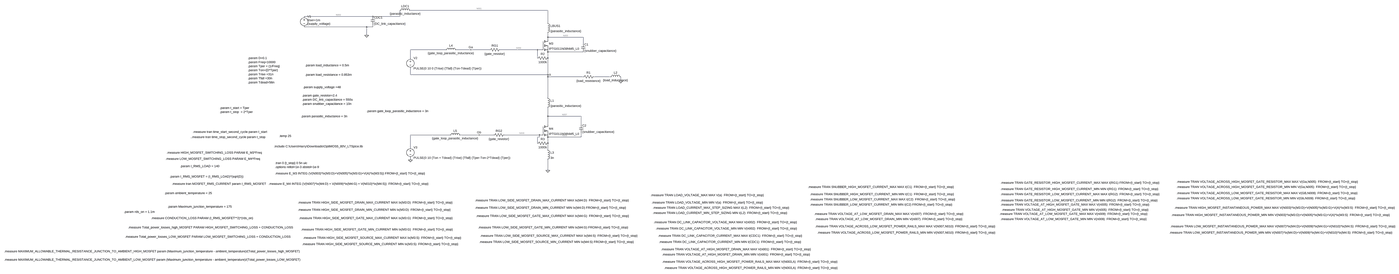
[diagram p0: schematic LTspice_simulation_ready.asc, whole sheet]
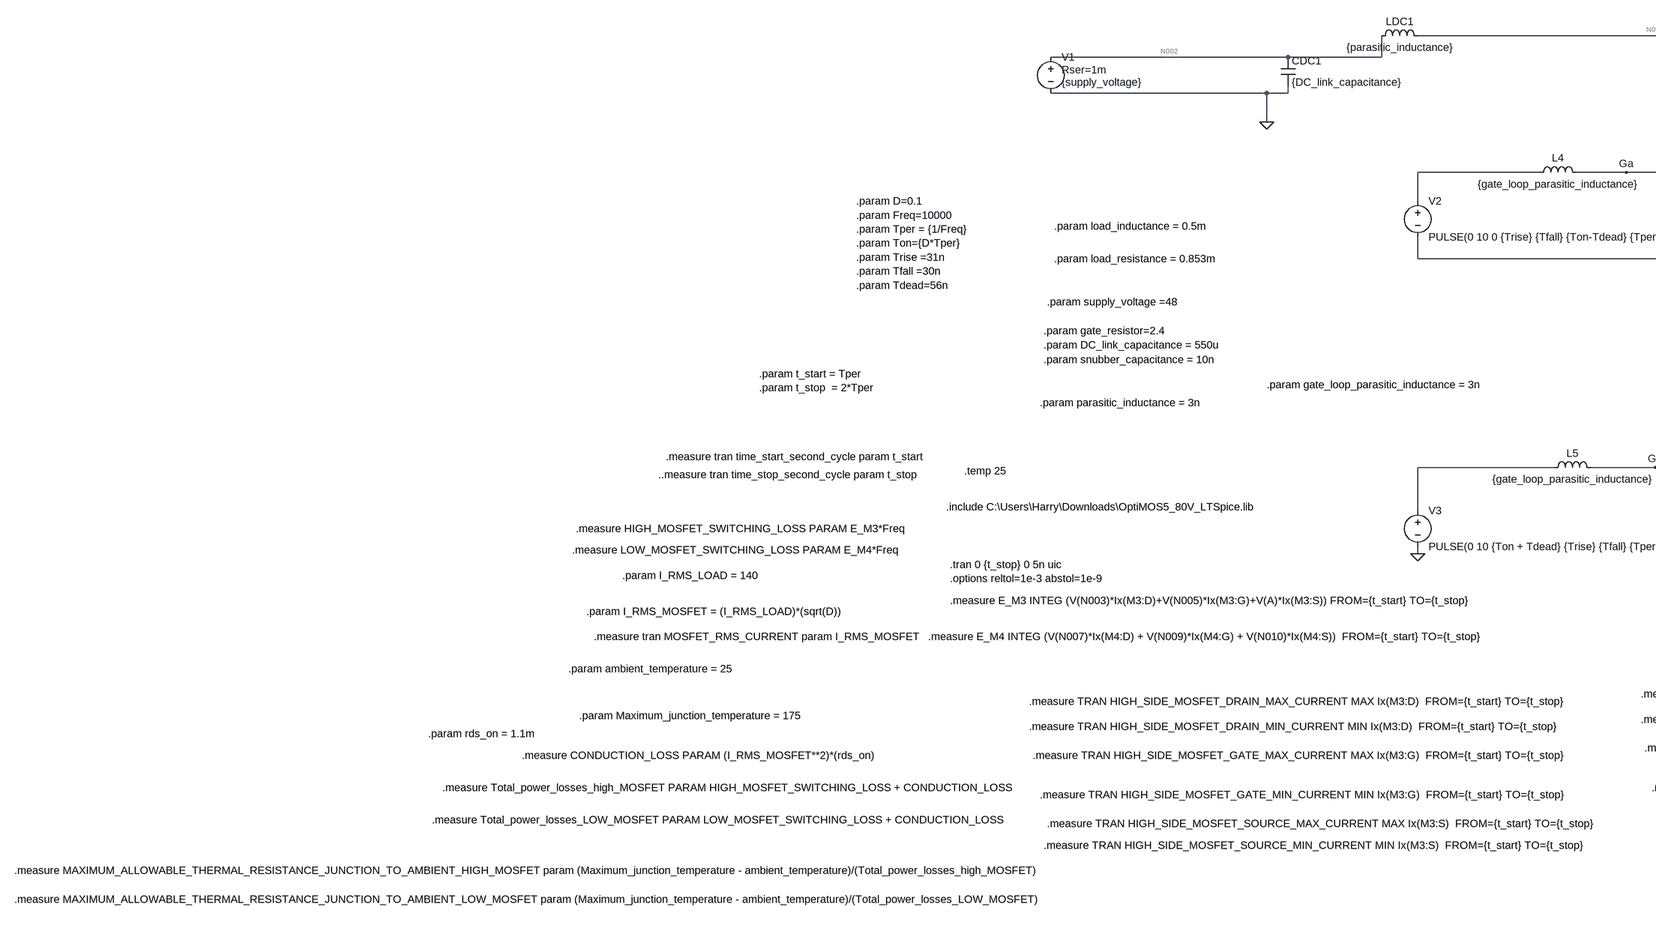
[diagram p1: schematic LTspice_simulation_ready.asc, part, row 1 of 1, column 1 of 3]
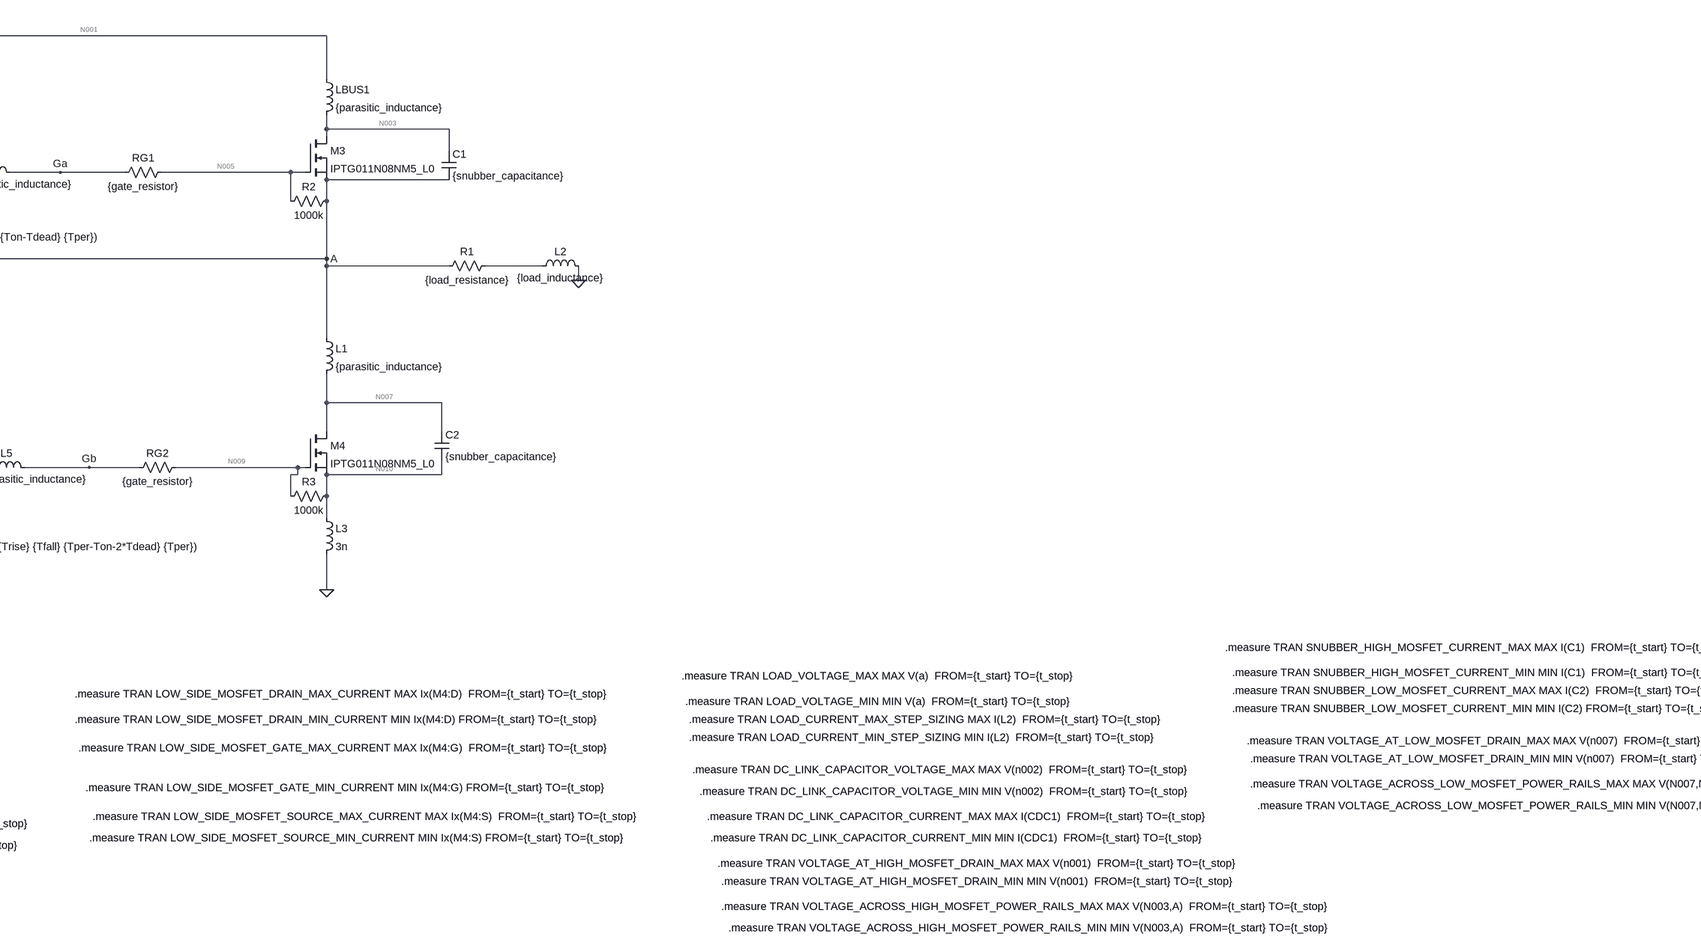
[diagram p2: schematic LTspice_simulation_ready.asc, part, row 1 of 1, column 2 of 3]
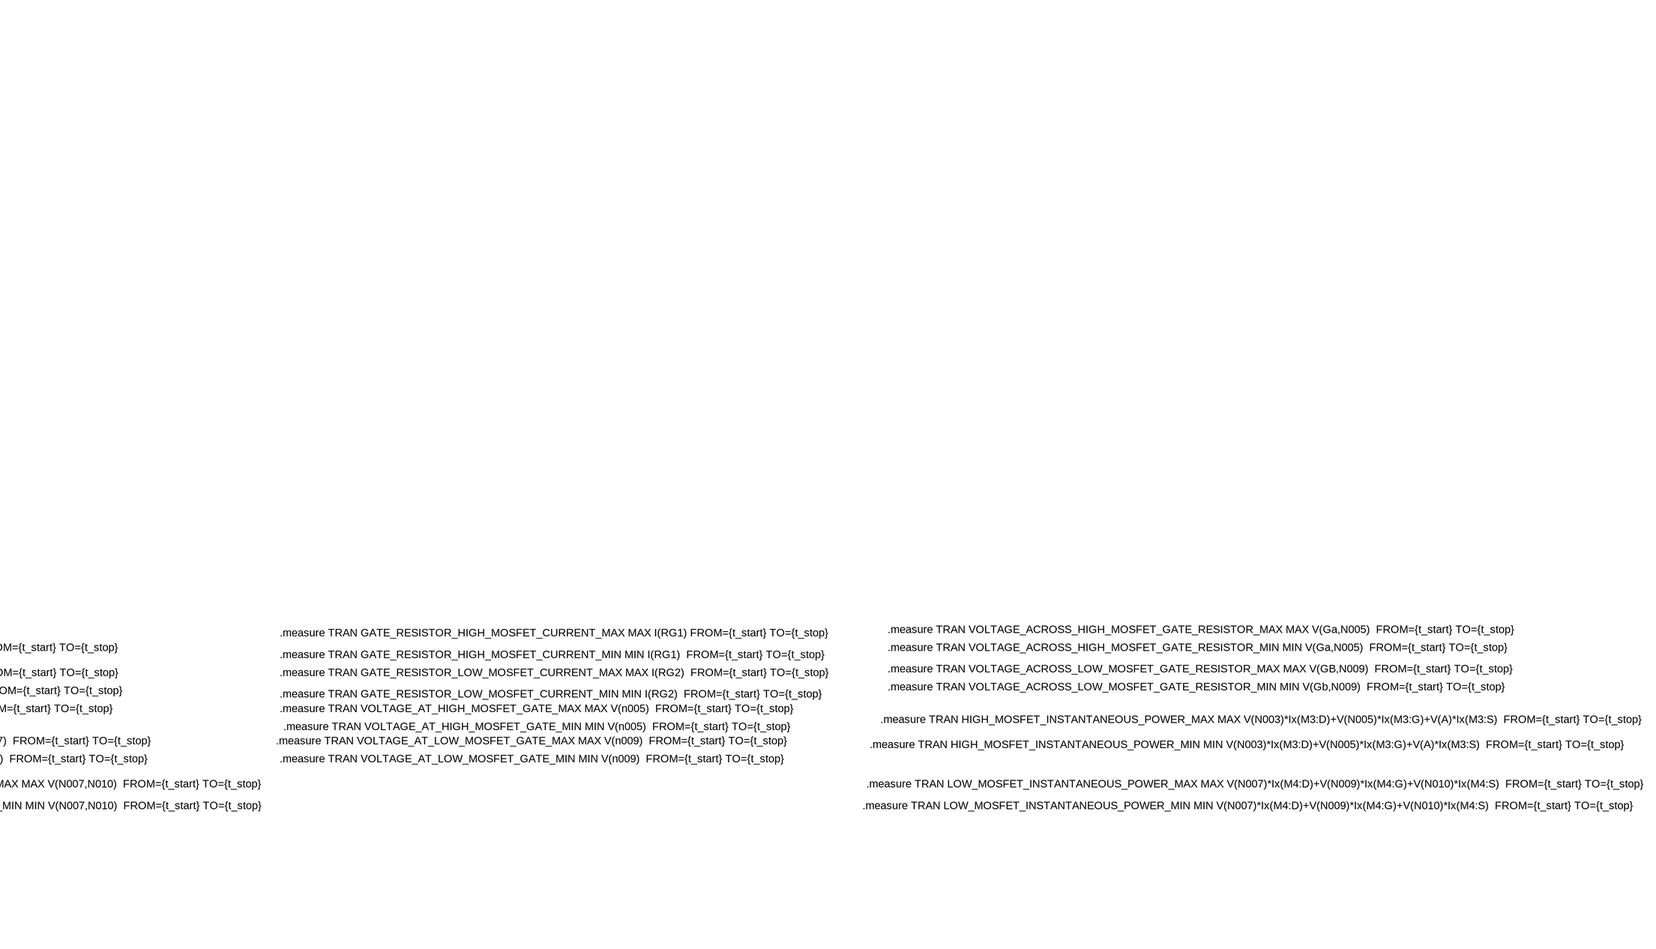
[diagram p3: schematic LTspice_simulation_ready.asc, part, row 1 of 1, column 3 of 3]
LTspice_simulation_ready.asc, the LTspice schematic file:
Version 4.1
SHEET 1 7924 1440
WIRE 1136 -560 80 -560
WIRE -208 -512 -736 -512
WIRE 0 -512 0 -560
WIRE 0 -512 -208 -512
WIRE 1136 -464 1136 -560
WIRE -256 -432 -736 -432
WIRE -208 -432 -208 -448
WIRE -208 -432 -256 -432
WIRE -256 -368 -256 -432
WIRE 1136 -352 1136 -384
WIRE 1408 -352 1136 -352
WIRE 1136 -336 1136 -352
WIRE 1408 -304 1408 -352
WIRE 352 -256 80 -256
WIRE 544 -256 432 -256
WIRE 688 -256 544 -256
WIRE 1056 -256 768 -256
WIRE 1088 -256 1056 -256
WIRE 1408 -240 1136 -240
WIRE 80 -192 80 -256
WIRE 1056 -192 1056 -256
WIRE 1136 -192 1136 -240
WIRE 80 -64 80 -112
WIRE 1136 -64 1136 -192
WIRE 1136 -64 80 -64
WIRE 1136 -48 1136 -64
WIRE 1408 -48 1136 -48
WIRE 1616 -48 1488 -48
WIRE 1696 -16 1696 -48
WIRE 1136 112 1136 -48
WIRE 1136 256 1136 192
WIRE 1392 256 1136 256
WIRE 1136 320 1136 256
WIRE 1392 320 1392 256
WIRE 384 400 80 400
WIRE 608 400 464 400
WIRE 720 400 608 400
WIRE 1072 400 800 400
WIRE 1088 400 1072 400
WIRE 1072 416 1072 400
WIRE 1072 416 1056 416
WIRE 1136 416 1136 400
WIRE 1392 416 1392 384
WIRE 1392 416 1136 416
WIRE 1056 464 1056 416
WIRE 1136 464 1136 416
WIRE 80 496 80 400
WIRE 1136 512 1136 464
WIRE 80 592 80 576
WIRE 1136 672 1136 592
FLAG 544 -256 Ga
FLAG 608 400 Gb
FLAG 1696 -16 0
FLAG 1136 -64 A
FLAG -256 -368 0
FLAG 1136 672 0
FLAG 80 592 0
SYMBOL voltage -736 -528 R0
WINDOW 123 0 0 Left 0
WINDOW 39 24 44 Left 2
WINDOW 3 24 72 Left 2
SYMATTR SpiceLine Rser=1m
SYMATTR Value {supply_voltage}
SYMATTR InstName V1
SYMBOL cap -224 -512 R0
SYMATTR InstName CDC1
SYMATTR Value {DC_link_capacitance}
SYMATTR SpiceLine Rser=1m
SYMBOL ind -16 -544 R270
WINDOW 0 32 56 VTop 2
WINDOW 3 5 56 VBottom 2
SYMATTR InstName LDC1
SYMATTR Value {parasitic_inductance}
SYMATTR SpiceLine Rser=1m
SYMBOL res 1504 -64 R90
WINDOW 0 0 56 VBottom 2
WINDOW 3 32 56 VTop 2
SYMATTR InstName R1
SYMATTR Value {load_resistance}
SYMBOL res 784 -272 R90
WINDOW 0 0 56 VBottom 2
WINDOW 3 32 56 VTop 2
SYMATTR InstName RG1
SYMATTR Value {gate_resistor}
SYMBOL res 816 384 R90
WINDOW 0 0 56 VBottom 2
WINDOW 3 32 56 VTop 2
SYMATTR InstName RG2
SYMATTR Value {gate_resistor}
SYMBOL ind 1120 -480 R0
SYMATTR InstName LBUS1
SYMATTR Value {parasitic_inductance}
SYMATTR SpiceLine Rser=1m
SYMBOL ind 1120 96 R0
SYMATTR InstName L1
SYMATTR Value {parasitic_inductance}
SYMATTR SpiceLine Rser=1m
SYMBOL ind 1600 -32 R270
WINDOW 0 32 56 VTop 2
WINDOW 3 5 56 VBottom 2
SYMATTR InstName L2
SYMATTR Value {load_inductance}
SYMATTR SpiceLine Rser=1m
SYMBOL ind 1120 496 R0
SYMATTR InstName L3
SYMATTR Value 3n
SYMATTR SpiceLine Rser=1m
SYMBOL voltage 80 -208 R0
WINDOW 123 0 0 Left 0
WINDOW 39 0 0 Left 0
SYMATTR InstName V2
SYMATTR Value PULSE(0 10 0 {Trise} {Tfall} {Ton-Tdead} {Tper})
SYMBOL voltage 80 480 R0
WINDOW 123 0 0 Left 0
WINDOW 39 0 0 Left 0
SYMATTR InstName V3
SYMATTR Value PULSE(0 10 {Ton + Tdead} {Trise} {Tfall} {Tper-Ton-2*Tdead} {Tper})
SYMBOL ind 336 -240 R270
WINDOW 0 32 56 VTop 2
WINDOW 3 5 56 VBottom 2
SYMATTR InstName L4
SYMATTR Value {gate_loop_parasitic_inductance}
SYMATTR SpiceLine Rser=1m
SYMBOL ind 368 416 R270
WINDOW 0 32 56 VTop 2
WINDOW 3 5 56 VBottom 2
SYMATTR InstName L5
SYMATTR Value {gate_loop_parasitic_inductance}
SYMATTR SpiceLine Rser=1m
SYMBOL res 1152 -208 R90
WINDOW 0 0 56 VBottom 2
WINDOW 3 32 56 VTop 2
SYMATTR InstName R2
SYMATTR Value 1000k
SYMBOL res 1152 448 R90
WINDOW 0 0 56 VBottom 2
WINDOW 3 32 56 VTop 2
SYMATTR InstName R3
SYMATTR Value 1000k
SYMBOL cap 1392 -304 R0
SYMATTR InstName C1
SYMATTR Value {snubber_capacitance}
SYMBOL cap 1376 320 R0
SYMATTR InstName C2
SYMATTR Value {snubber_capacitance}
SYMBOL nmos 1088 -336 R0
SYMATTR InstName M3
SYMATTR Value IPTG011N08NM5_L0
SYMATTR Prefix X
SYMBOL nmos 1088 320 R0
SYMATTR InstName M4
SYMATTR Value IPTG011N08NM5_L0
SYMATTR Prefix X
TEXT -1168 -192 Left 2 !.param D=0.1\n.param Freq=10000\n.param Tper = {1/Freq}\n.param Ton={D*Tper}\n.param Trise =31n\n.param Tfall =30n\n.param Tdead=56n
TEXT -960 616 Left 2 !.tran 0 {t_stop} 0 5n uic\n.options reltol=1e-3 abstol=1e-9
TEXT -968 488 Left 2 !.include C:\\Users\\Harry\\Downloads\\OptiMOS5_80V_LTSpice.lib
TEXT -928 408 Left 2 !.temp 25
TEXT -752 160 Left 2 !.param snubber_capacitance = 10n
TEXT -752 128 Left 2 !.param DC_link_capacitance = 550u
TEXT -752 96 Left 2 !.param gate_resistor=2.4
TEXT -744 32 Left 2 !.param supply_voltage =48
TEXT -728 -64 Left 2 !.param load_resistance = 0.853m
TEXT -728 -136 Left 2 !.param load_inductance = 0.5m
TEXT -760 256 Left 2 !.param parasitic_inductance = 3n
TEXT -960 696 Left 2 !.measure E_M3 INTEG (V(N003)*Ix(M3:D)+V(N005)*Ix(M3:G)+V(A)*Ix(M3:S)) FROM={t_start} TO={t_stop}
TEXT -1008 776 Left 2 !.measure E_M4 INTEG (V(N007)*Ix(M4:D) + V(N009)*Ix(M4:G) + V(N010)*Ix(M4:S))  FROM={t_start} TO={t_stop}
TEXT -784 920 Left 2 !.measure TRAN HIGH_SIDE_MOSFET_DRAIN_MAX_CURRENT MAX Ix(M3:D)  FROM={t_start} TO={t_stop}
TEXT -784 976 Left 2 !.measure TRAN HIGH_SIDE_MOSFET_DRAIN_MIN_CURRENT MIN Ix(M3:D)  FROM={t_start} TO={t_stop}
TEXT -776 1040 Left 2 !.measure TRAN HIGH_SIDE_MOSFET_GATE_MAX_CURRENT MAX Ix(M3:G)  FROM={t_start} TO={t_stop}
TEXT -760 1128 Left 2 !.measure TRAN HIGH_SIDE_MOSFET_GATE_MIN_CURRENT MIN Ix(M3:G)  FROM={t_start} TO={t_stop}
TEXT -752 1240 Left 2 !.measure TRAN HIGH_SIDE_MOSFET_SOURCE_MIN_CURRENT MIN Ix(M3:S)  FROM={t_start} TO={t_stop}
TEXT -744 1192 Left 2 !.measure TRAN HIGH_SIDE_MOSFET_SOURCE_MAX_CURRENT MAX Ix(M3:S)  FROM={t_start} TO={t_stop}
TEXT 576 904 Left 2 !.measure TRAN LOW_SIDE_MOSFET_DRAIN_MAX_CURRENT MAX Ix(M4:D)  FROM={t_start} TO={t_stop}
TEXT 576 960 Left 2 !.measure TRAN LOW_SIDE_MOSFET_DRAIN_MIN_CURRENT MIN Ix(M4:D) FROM={t_start} TO={t_stop}
TEXT 584 1024 Left 2 !.measure TRAN LOW_SIDE_MOSFET_GATE_MAX_CURRENT MAX Ix(M4:G)  FROM={t_start} TO={t_stop}
TEXT 600 1112 Left 2 !.measure TRAN LOW_SIDE_MOSFET_GATE_MIN_CURRENT MIN Ix(M4:G) FROM={t_start} TO={t_stop}
TEXT 608 1224 Left 2 !.measure TRAN LOW_SIDE_MOSFET_SOURCE_MIN_CURRENT MIN Ix(M4:S) FROM={t_start} TO={t_stop}
TEXT 616 1176 Left 2 !.measure TRAN LOW_SIDE_MOSFET_SOURCE_MAX_CURRENT MAX Ix(M4:S)  FROM={t_start} TO={t_stop}
TEXT 2072 864 Left 2 !.measure TRAN LOAD_VOLTAGE_MAX MAX V(a)  FROM={t_start} TO={t_stop}
TEXT 2080 920 Left 2 !.measure TRAN LOAD_VOLTAGE_MIN MIN V(a)  FROM={t_start} TO={t_stop}
TEXT 2088 960 Left 2 !.measure TRAN LOAD_CURRENT_MAX_STEP_SIZING MAX I(L2)  FROM={t_start} TO={t_stop}
TEXT 2088 1000 Left 2 !.measure TRAN LOAD_CURRENT_MIN_STEP_SIZING MIN I(L2)  FROM={t_start} TO={t_stop}
TEXT 2096 1072 Left 2 !.measure TRAN DC_LINK_CAPACITOR_VOLTAGE_MAX MAX V(n002)  FROM={t_start} TO={t_stop}
TEXT 2112 1120 Left 2 !.measure TRAN DC_LINK_CAPACITOR_VOLTAGE_MIN MIN V(n002)  FROM={t_start} TO={t_stop}
TEXT 2128 1176 Left 2 !.measure TRAN DC_LINK_CAPACITOR_CURRENT_MAX MAX I(CDC1)  FROM={t_start} TO={t_stop}
TEXT 2136 1224 Left 2 !.measure TRAN DC_LINK_CAPACITOR_CURRENT_MIN MIN I(CDC1)  FROM={t_start} TO={t_stop}
TEXT 2152 1280 Left 2 !.measure TRAN VOLTAGE_AT_HIGH_MOSFET_DRAIN_MAX MAX V(n001)  FROM={t_start} TO={t_stop}
TEXT 2160 1320 Left 2 !.measure TRAN VOLTAGE_AT_HIGH_MOSFET_DRAIN_MIN MIN V(n001)  FROM={t_start} TO={t_stop}
TEXT 2160 1376 Left 2 !.measure TRAN VOLTAGE_ACROSS_HIGH_MOSFET_POWER_RAILS_MAX MAX V(N003,A)  FROM={t_start} TO={t_stop}
TEXT 2176 1424 Left 2 !.measure TRAN VOLTAGE_ACROSS_HIGH_MOSFET_POWER_RAILS_MIN MIN V(N003,A)  FROM={t_start} TO={t_stop}
TEXT 3280 800 Left 2 !.measure TRAN SNUBBER_HIGH_MOSFET_CURRENT_MAX MAX I(C1)  FROM={t_start} TO={t_stop}
TEXT 3296 856 Left 2 !.measure TRAN SNUBBER_HIGH_MOSFET_CURRENT_MIN MIN I(C1)  FROM={t_start} TO={t_stop}
TEXT 3296 896 Left 2 !.measure TRAN SNUBBER_LOW_MOSFET_CURRENT_MAX MAX I(C2)  FROM={t_start} TO={t_stop}
TEXT 3296 936 Left 2 !.measure TRAN SNUBBER_LOW_MOSFET_CURRENT_MIN MIN I(C2) FROM={t_start} TO={t_stop}
TEXT 3328 1008 Left 2 !.measure TRAN VOLTAGE_AT_LOW_MOSFET_DRAIN_MAX MAX V(n007)  FROM={t_start} TO={t_stop}
TEXT 3336 1048 Left 2 !.measure TRAN VOLTAGE_AT_LOW_MOSFET_DRAIN_MIN MIN V(n007)  FROM={t_start} TO={t_stop}
TEXT 3336 1104 Left 2 !.measure TRAN VOLTAGE_ACROSS_LOW_MOSFET_POWER_RAILS_MAX MAX V(N007,N010)  FROM={t_start} TO={t_stop}
TEXT 3352 1152 Left 2 !.measure TRAN VOLTAGE_ACROSS_LOW_MOSFET_POWER_RAILS_MIN MIN V(N007,N010)  FROM={t_start} TO={t_stop}
TEXT 4760 768 Left 2 !.measure TRAN GATE_RESISTOR_HIGH_MOSFET_CURRENT_MAX MAX I(RG1) FROM={t_start} TO={t_stop}
TEXT 4760 816 Left 2 !.measure TRAN GATE_RESISTOR_HIGH_MOSFET_CURRENT_MIN MIN I(RG1)  FROM={t_start} TO={t_stop}
TEXT 4760 856 Left 2 !.measure TRAN GATE_RESISTOR_LOW_MOSFET_CURRENT_MAX MAX I(RG2)  FROM={t_start} TO={t_stop}
TEXT 4760 904 Left 2 !.measure TRAN GATE_RESISTOR_LOW_MOSFET_CURRENT_MIN MIN I(RG2)  FROM={t_start} TO={t_stop}
TEXT 4760 936 Left 2 !.measure TRAN VOLTAGE_AT_HIGH_MOSFET_GATE_MAX MAX V(n005)  FROM={t_start} TO={t_stop}
TEXT 4768 976 Left 2 !.measure TRAN VOLTAGE_AT_HIGH_MOSFET_GATE_MIN MIN V(n005)  FROM={t_start} TO={t_stop}
TEXT 4752 1008 Left 2 !.measure TRAN VOLTAGE_AT_LOW_MOSFET_GATE_MAX MAX V(n009)  FROM={t_start} TO={t_stop}
TEXT 4760 1048 Left 2 !.measure TRAN VOLTAGE_AT_LOW_MOSFET_GATE_MIN MIN V(n009)  FROM={t_start} TO={t_stop}
TEXT 6112 760 Left 2 !.measure TRAN VOLTAGE_ACROSS_HIGH_MOSFET_GATE_RESISTOR_MAX MAX V(Ga,N005)  FROM={t_start} TO={t_stop}
TEXT 6112 800 Left 2 !.measure TRAN VOLTAGE_ACROSS_HIGH_MOSFET_GATE_RESISTOR_MIN MIN V(Ga,N005)  FROM={t_start} TO={t_stop}
TEXT 6112 848 Left 2 !.measure TRAN VOLTAGE_ACROSS_LOW_MOSFET_GATE_RESISTOR_MAX MAX V(GB,N009)  FROM={t_start} TO={t_stop}
TEXT 6112 888 Left 2 !.measure TRAN VOLTAGE_ACROSS_LOW_MOSFET_GATE_RESISTOR_MIN MIN V(Gb,N009)  FROM={t_start} TO={t_stop}
TEXT 6096 960 Left 2 !.measure TRAN HIGH_MOSFET_INSTANTANEOUS_POWER_MAX MAX V(N003)*Ix(M3:D)+V(N005)*Ix(M3:G)+V(A)*Ix(M3:S)  FROM={t_start} TO={t_stop}
TEXT 6072 1016 Left 2 !.measure TRAN HIGH_MOSFET_INSTANTANEOUS_POWER_MIN MIN V(N003)*Ix(M3:D)+V(N005)*Ix(M3:G)+V(A)*Ix(M3:S)  FROM={t_start} TO={t_stop}
TEXT 6064 1104 Left 2 !.measure TRAN LOW_MOSFET_INSTANTANEOUS_POWER_MAX MAX V(N007)*Ix(M4:D)+V(N009)*Ix(M4:G)+V(N010)*Ix(M4:S)  FROM={t_start} TO={t_stop}
TEXT 6056 1152 Left 2 !.measure TRAN LOW_MOSFET_INSTANTANEOUS_POWER_MIN MIN V(N007)*Ix(M4:D)+V(N009)*Ix(M4:G)+V(N010)*Ix(M4:S)  FROM={t_start} TO={t_stop}
TEXT -256 216 Left 2 !.param gate_loop_parasitic_inductance = 3n
TEXT -1384 192 Left 2 !.param t_start = Tper\n.param t_stop  = 2*Tper
TEXT -1592 376 Left 2 !.measure tran time_start_second_cycle param t_start
TEXT -1608 416 Left 2 !..measure tran time_stop_second_cycle param t_stop
TEXT -1792 536 Left 2 !.measure HIGH_MOSFET_SWITCHING_LOSS PARAM E_M3*Freq
TEXT -1800 584 Left 2 !.measure LOW_MOSFET_SWITCHING_LOSS PARAM E_M4*Freq
TEXT -1688 640 Left 2 !.param I_RMS_LOAD = 140
TEXT -1768 720 Left 2 !.param I_RMS_MOSFET = (I_RMS_LOAD)*(sqrt(D))
TEXT -1752 776 Left 2 !.measure tran MOSFET_RMS_CURRENT param I_RMS_MOSFET
TEXT -1808 848 Left 2 !.param ambient_temperature = 25
TEXT -1784 952 Left 2 !.param Maximum_junction_temperature = 175
TEXT -2088 1112 Left 2 !.measure Total_power_losses_high_MOSFET PARAM HIGH_MOSFET_SWITCHING_LOSS + CONDUCTION_LOSS
TEXT -1912 1040 Left 2 !.measure CONDUCTION_LOSS PARAM (I_RMS_MOSFET**2)*(rds_on)
TEXT -2120 992 Left 2 !.param rds_on = 1.1m
TEXT -2112 1184 Left 2 !.measure Total_power_losses_LOW_MOSFET PARAM LOW_MOSFET_SWITCHING_LOSS + CONDUCTION_LOSS
TEXT -3040 1296 Left 2 !.measure MAXIMUM_ALLOWABLE_THERMAL_RESISTANCE_JUNCTION_TO_AMBIENT_HIGH_MOSFET param (Maximum_junction_temperature - ambient_temperature)/(Total_power_losses_high_MOSFET)
TEXT -3040 1360 Left 2 !.measure MAXIMUM_ALLOWABLE_THERMAL_RESISTANCE_JUNCTION_TO_AMBIENT_LOW_MOSFET param (Maximum_junction_temperature - ambient_temperature)/(Total_power_losses_LOW_MOSFET)

The netlist it stands for:
* LTspice_simulation_ready.asc
V1 N002 0 {supply_voltage} Rser=1m
CDC1 N002 0 {DC_link_capacitance} Rser=1m
LDC1 N002 N001 {parasitic_inductance} Rser=1m
R1 N006 A {load_resistance}
RG1 N005 Ga {gate_resistor}
RG2 N009 Gb {gate_resistor}
LBUS1 N001 N003 {parasitic_inductance} Rser=1m
L1 A N007 {parasitic_inductance} Rser=1m
L2 N006 0 {load_inductance} Rser=1m
L3 N010 0 3n Rser=1m
V2 N004 A PULSE(0 10 0 {Trise} {Tfall} {Ton-Tdead} {Tper})
V3 N008 0 PULSE(0 10 {Ton + Tdead} {Trise} {Tfall} {Tper-Ton-2*Tdead} {Tper})
L4 N004 Ga {gate_loop_parasitic_inductance} Rser=1m
L5 N008 Gb {gate_loop_parasitic_inductance} Rser=1m
R2 A N005 1000k
R3 N010 N009 1000k
C1 N003 A {snubber_capacitance}
C2 N007 N010 {snubber_capacitance}
X§M3 N003 N005 A IPTG011N08NM5_L0  ; pins D G S
X§M4 N007 N009 N010 IPTG011N08NM5_L0  ; pins D G S
.param D=0.1
.param Freq=10000
.param Tper = {1/Freq}
.param Ton={D*Tper}
.param Trise =31n
.param Tfall =30n
.param Tdead=56n
.tran 0 {t_stop} 0 5n uic
.options reltol=1e-3 abstol=1e-9
.include C:\Users\Harry\Downloads\OptiMOS5_80V_LTSpice.lib
.temp 25
.param snubber_capacitance = 10n
.param DC_link_capacitance = 550u
.param gate_resistor=2.4
.param supply_voltage =48
.param load_resistance = 0.853m
.param load_inductance = 0.5m
.param parasitic_inductance = 3n
.measure E_M3 INTEG (V(N003)*Ix(M3:D)+V(N005)*Ix(M3:G)+V(A)*Ix(M3:S)) FROM={t_start} TO={t_stop}
.measure E_M4 INTEG (V(N007)*Ix(M4:D) + V(N009)*Ix(M4:G) + V(N010)*Ix(M4:S))  FROM={t_start} TO={t_stop}
.measure TRAN HIGH_SIDE_MOSFET_DRAIN_MAX_CURRENT MAX Ix(M3:D)  FROM={t_start} TO={t_stop}
.measure TRAN HIGH_SIDE_MOSFET_DRAIN_MIN_CURRENT MIN Ix(M3:D)  FROM={t_start} TO={t_stop}
.measure TRAN HIGH_SIDE_MOSFET_GATE_MAX_CURRENT MAX Ix(M3:G)  FROM={t_start} TO={t_stop}
.measure TRAN HIGH_SIDE_MOSFET_GATE_MIN_CURRENT MIN Ix(M3:G)  FROM={t_start} TO={t_stop}
.measure TRAN HIGH_SIDE_MOSFET_SOURCE_MIN_CURRENT MIN Ix(M3:S)  FROM={t_start} TO={t_stop}
.measure TRAN HIGH_SIDE_MOSFET_SOURCE_MAX_CURRENT MAX Ix(M3:S)  FROM={t_start} TO={t_stop}
.measure TRAN LOW_SIDE_MOSFET_DRAIN_MAX_CURRENT MAX Ix(M4:D)  FROM={t_start} TO={t_stop}
.measure TRAN LOW_SIDE_MOSFET_DRAIN_MIN_CURRENT MIN Ix(M4:D) FROM={t_start} TO={t_stop}
.measure TRAN LOW_SIDE_MOSFET_GATE_MAX_CURRENT MAX Ix(M4:G)  FROM={t_start} TO={t_stop}
.measure TRAN LOW_SIDE_MOSFET_GATE_MIN_CURRENT MIN Ix(M4:G) FROM={t_start} TO={t_stop}
.measure TRAN LOW_SIDE_MOSFET_SOURCE_MIN_CURRENT MIN Ix(M4:S) FROM={t_start} TO={t_stop}
.measure TRAN LOW_SIDE_MOSFET_SOURCE_MAX_CURRENT MAX Ix(M4:S)  FROM={t_start} TO={t_stop}
.measure TRAN LOAD_VOLTAGE_MAX MAX V(a)  FROM={t_start} TO={t_stop}
.measure TRAN LOAD_VOLTAGE_MIN MIN V(a)  FROM={t_start} TO={t_stop}
.measure TRAN LOAD_CURRENT_MAX_STEP_SIZING MAX I(L2)  FROM={t_start} TO={t_stop}
.measure TRAN LOAD_CURRENT_MIN_STEP_SIZING MIN I(L2)  FROM={t_start} TO={t_stop}
.measure TRAN DC_LINK_CAPACITOR_VOLTAGE_MAX MAX V(n002)  FROM={t_start} TO={t_stop}
.measure TRAN DC_LINK_CAPACITOR_VOLTAGE_MIN MIN V(n002)  FROM={t_start} TO={t_stop}
.measure TRAN DC_LINK_CAPACITOR_CURRENT_MAX MAX I(CDC1)  FROM={t_start} TO={t_stop}
.measure TRAN DC_LINK_CAPACITOR_CURRENT_MIN MIN I(CDC1)  FROM={t_start} TO={t_stop}
.measure TRAN VOLTAGE_AT_HIGH_MOSFET_DRAIN_MAX MAX V(n001)  FROM={t_start} TO={t_stop}
.measure TRAN VOLTAGE_AT_HIGH_MOSFET_DRAIN_MIN MIN V(n001)  FROM={t_start} TO={t_stop}
.measure TRAN VOLTAGE_ACROSS_HIGH_MOSFET_POWER_RAILS_MAX MAX V(N003,A)  FROM={t_start} TO={t_stop}
.measure TRAN VOLTAGE_ACROSS_HIGH_MOSFET_POWER_RAILS_MIN MIN V(N003,A)  FROM={t_start} TO={t_stop}
.measure TRAN SNUBBER_HIGH_MOSFET_CURRENT_MAX MAX I(C1)  FROM={t_start} TO={t_stop}
.measure TRAN SNUBBER_HIGH_MOSFET_CURRENT_MIN MIN I(C1)  FROM={t_start} TO={t_stop}
.measure TRAN SNUBBER_LOW_MOSFET_CURRENT_MAX MAX I(C2)  FROM={t_start} TO={t_stop}
.measure TRAN SNUBBER_LOW_MOSFET_CURRENT_MIN MIN I(C2) FROM={t_start} TO={t_stop}
.measure TRAN VOLTAGE_AT_LOW_MOSFET_DRAIN_MAX MAX V(n007)  FROM={t_start} TO={t_stop}
.measure TRAN VOLTAGE_AT_LOW_MOSFET_DRAIN_MIN MIN V(n007)  FROM={t_start} TO={t_stop}
.measure TRAN VOLTAGE_ACROSS_LOW_MOSFET_POWER_RAILS_MAX MAX V(N007,N010)  FROM={t_start} TO={t_stop}
.measure TRAN VOLTAGE_ACROSS_LOW_MOSFET_POWER_RAILS_MIN MIN V(N007,N010)  FROM={t_start} TO={t_stop}
.measure TRAN GATE_RESISTOR_HIGH_MOSFET_CURRENT_MAX MAX I(RG1) FROM={t_start} TO={t_stop}
.measure TRAN GATE_RESISTOR_HIGH_MOSFET_CURRENT_MIN MIN I(RG1)  FROM={t_start} TO={t_stop}
.measure TRAN GATE_RESISTOR_LOW_MOSFET_CURRENT_MAX MAX I(RG2)  FROM={t_start} TO={t_stop}
.measure TRAN GATE_RESISTOR_LOW_MOSFET_CURRENT_MIN MIN I(RG2)  FROM={t_start} TO={t_stop}
.measure TRAN VOLTAGE_AT_HIGH_MOSFET_GATE_MAX MAX V(n005)  FROM={t_start} TO={t_stop}
.measure TRAN VOLTAGE_AT_HIGH_MOSFET_GATE_MIN MIN V(n005)  FROM={t_start} TO={t_stop}
.measure TRAN VOLTAGE_AT_LOW_MOSFET_GATE_MAX MAX V(n009)  FROM={t_start} TO={t_stop}
.measure TRAN VOLTAGE_AT_LOW_MOSFET_GATE_MIN MIN V(n009)  FROM={t_start} TO={t_stop}
.measure TRAN VOLTAGE_ACROSS_HIGH_MOSFET_GATE_RESISTOR_MAX MAX V(Ga,N005)  FROM={t_start} TO={t_stop}
.measure TRAN VOLTAGE_ACROSS_HIGH_MOSFET_GATE_RESISTOR_MIN MIN V(Ga,N005)  FROM={t_start} TO={t_stop}
.measure TRAN VOLTAGE_ACROSS_LOW_MOSFET_GATE_RESISTOR_MAX MAX V(GB,N009)  FROM={t_start} TO={t_stop}
.measure TRAN VOLTAGE_ACROSS_LOW_MOSFET_GATE_RESISTOR_MIN MIN V(Gb,N009)  FROM={t_start} TO={t_stop}
.measure TRAN HIGH_MOSFET_INSTANTANEOUS_POWER_MAX MAX V(N003)*Ix(M3:D)+V(N005)*Ix(M3:G)+V(A)*Ix(M3:S)  FROM={t_start} TO={t_stop}
.measure TRAN HIGH_MOSFET_INSTANTANEOUS_POWER_MIN MIN V(N003)*Ix(M3:D)+V(N005)*Ix(M3:G)+V(A)*Ix(M3:S)  FROM={t_start} TO={t_stop}
.measure TRAN LOW_MOSFET_INSTANTANEOUS_POWER_MAX MAX V(N007)*Ix(M4:D)+V(N009)*Ix(M4:G)+V(N010)*Ix(M4:S)  FROM={t_start} TO={t_stop}
.measure TRAN LOW_MOSFET_INSTANTANEOUS_POWER_MIN MIN V(N007)*Ix(M4:D)+V(N009)*Ix(M4:G)+V(N010)*Ix(M4:S)  FROM={t_start} TO={t_stop}
.param gate_loop_parasitic_inductance = 3n
.param t_start = Tper
.param t_stop  = 2*Tper
.measure tran time_start_second_cycle param t_start
..measure tran time_stop_second_cycle param t_stop
.measure HIGH_MOSFET_SWITCHING_LOSS PARAM E_M3*Freq
.measure LOW_MOSFET_SWITCHING_LOSS PARAM E_M4*Freq
.param I_RMS_LOAD = 140
.param I_RMS_MOSFET = (I_RMS_LOAD)*(sqrt(D))
.measure tran MOSFET_RMS_CURRENT param I_RMS_MOSFET
.param ambient_temperature = 25
.param Maximum_junction_temperature = 175
.measure Total_power_losses_high_MOSFET PARAM HIGH_MOSFET_SWITCHING_LOSS + CONDUCTION_LOSS
.measure CONDUCTION_LOSS PARAM (I_RMS_MOSFET**2)*(rds_on)
.param rds_on = 1.1m
.measure Total_power_losses_LOW_MOSFET PARAM LOW_MOSFET_SWITCHING_LOSS + CONDUCTION_LOSS
.measure MAXIMUM_ALLOWABLE_THERMAL_RESISTANCE_JUNCTION_TO_AMBIENT_HIGH_MOSFET param (Maximum_junction_temperature - ambient_temperature)/(Total_power_losses_high_MOSFET)
.measure MAXIMUM_ALLOWABLE_THERMAL_RESISTANCE_JUNCTION_TO_AMBIENT_LOW_MOSFET param (Maximum_junction_temperature - ambient_temperature)/(Total_power_losses_LOW_MOSFET)
.backanno
.end